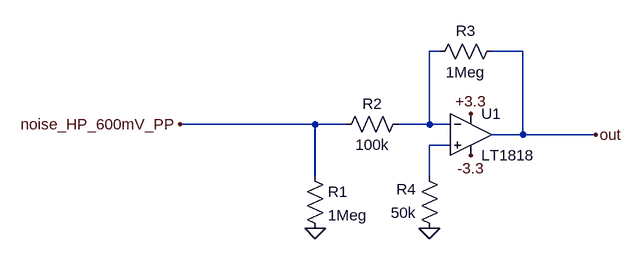
[diagram p0: schematic acOK1.asc]
acOK1.asc, the LTspice schematic file:
Version 4
SHEET 1 880 680
WIRE 176 32 160 32
WIRE 304 32 256 32
WIRE -16 144 -224 144
WIRE 32 144 -16 144
WIRE 160 144 160 32
WIRE 160 144 112 144
WIRE 192 144 160 144
WIRE 304 160 304 32
WIRE 304 160 256 160
WIRE 416 160 304 160
WIRE 192 176 160 176
WIRE -16 224 -16 144
WIRE 160 224 160 176
FLAG 224 128 +3.3
FLAG 224 192 -3.3
FLAG 160 304 0
FLAG -16 304 0
FLAG -224 144 noise_HP_600mV_PP
FLAG 416 160 out
SYMBOL Opamps\\LT1818 224 160 R0
SYMATTR InstName U1
SYMBOL res -32 208 R0
SYMATTR InstName R1
SYMATTR Value 1Meg
SYMBOL res 128 128 R90
WINDOW 0 0 56 VBottom 2
WINDOW 3 32 56 VTop 2
SYMATTR InstName R2
SYMATTR Value 100k
SYMBOL res 272 16 R90
WINDOW 0 0 56 VBottom 2
WINDOW 3 32 56 VTop 2
SYMATTR InstName R3
SYMATTR Value 1Meg
SYMBOL res 176 320 R180
WINDOW 0 36 76 Left 2
WINDOW 3 36 40 Left 2
SYMATTR InstName R4
SYMATTR Value 50k

The netlist it stands for:
* acOK1.asc
XU1 N002 N001 out +3.3 -3.3 LT1818  ; pins In+ In- OUT V+ V-
R1 noise_HP_600mV_PP 0 1Meg
R2 N001 noise_HP_600mV_PP 100k
R3 out N001 1Meg
R4 0 N002 50k
.lib LTC2.lib
.backanno
.end